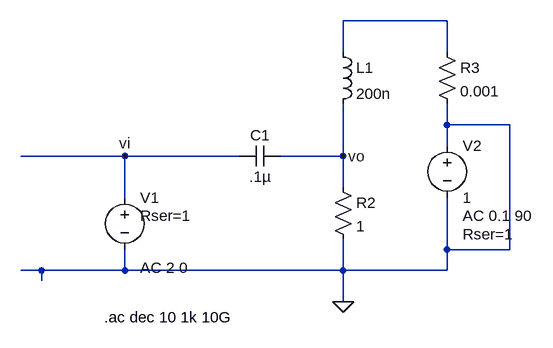
[diagram p0: schematic Bias-T.asc]
Bias-T.asc, the LTspice schematic file:
Version 4
SHEET 1 880 680
WIRE 528 -144 368 -144
WIRE 368 -96 368 -144
WIRE 528 -96 528 -144
WIRE 528 16 528 -16
WIRE 624 16 528 16
WIRE 528 48 528 16
WIRE 32 64 -128 64
WIRE 208 64 32 64
WIRE 368 64 368 -16
WIRE 368 64 272 64
WIRE 368 112 368 64
WIRE 32 128 32 64
WIRE 528 208 528 128
WIRE 624 208 624 16
WIRE 624 208 528 208
WIRE -96 240 -128 240
WIRE 32 240 32 208
WIRE 32 240 -96 240
WIRE 368 240 368 192
WIRE 368 240 32 240
WIRE 528 240 528 208
WIRE 528 240 368 240
WIRE -96 256 -96 240
WIRE 368 288 368 240
FLAG 368 288 0
FLAG 368 64 vo
FLAG 32 64 vi
SYMBOL voltage 32 112 R0
WINDOW 123 24 124 Left 2
WINDOW 39 24 44 Left 2
SYMATTR Value2 AC 2 0
SYMATTR SpiceLine Rser=1
SYMATTR InstName V1
SYMATTR Value ""
SYMBOL cap 272 48 R90
WINDOW 0 0 32 VBottom 2
WINDOW 3 32 32 VTop 2
SYMATTR InstName C1
SYMATTR Value .1µ
SYMBOL ind 352 -112 R0
SYMATTR InstName L1
SYMATTR Value 200n
SYMBOL res 352 96 R0
SYMATTR InstName R2
SYMATTR Value 1
SYMBOL voltage 528 32 R0
WINDOW 123 24 124 Left 2
WINDOW 39 24 152 Left 2
SYMATTR Value2 AC 0.1 90
SYMATTR SpiceLine Rser=1
SYMATTR InstName V2
SYMATTR Value 1
SYMBOL res 512 -112 R0
SYMATTR InstName R3
SYMATTR Value 0.001
TEXT 0 312 Left 2 !.ac dec 10 1k 10G

The netlist it stands for:
* Bias-T.asc
V1 vi 0 AC 2 0 Rser=1
C1 vo vi .1µ
L1 N001 vo 200n
R2 vo 0 1
V2 0 0 1 AC 0.1 90 Rser=1
R3 N001 0 0.001
.ac dec 10 1k 10G
.backanno
.end

* Results of the author's LTspice run, read from the files saved beside the schematic
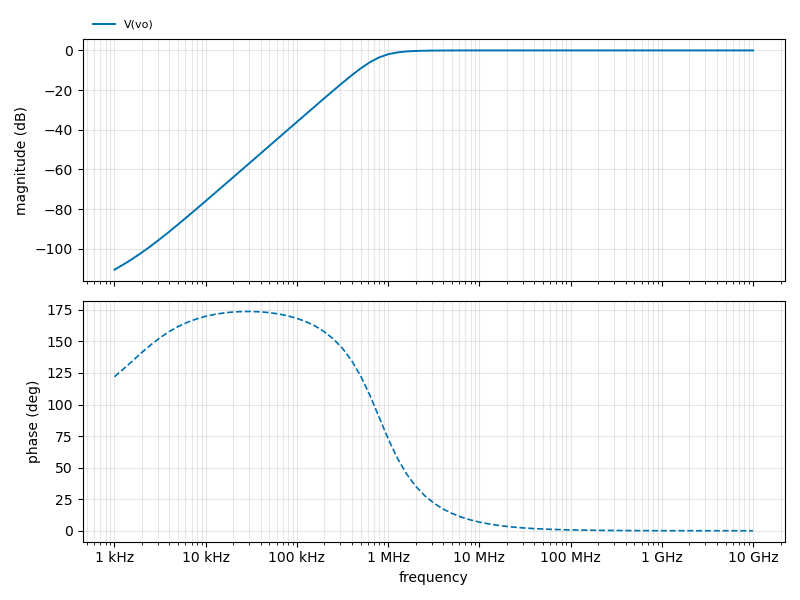
[diagram p1: AC Analysis of Bias-T.asc, plotted from the saved traces]
* AC Analysis, 1 run:
*   V(vo): -110.57 dB at 1 kHz, -0.00 dB at 10 GHz, peak -0.00 dB at 10 GHz, 3 dB below the peak at 857.9 kHz